# EAGLE design ESpdesign (EAGLE 9.6.2)
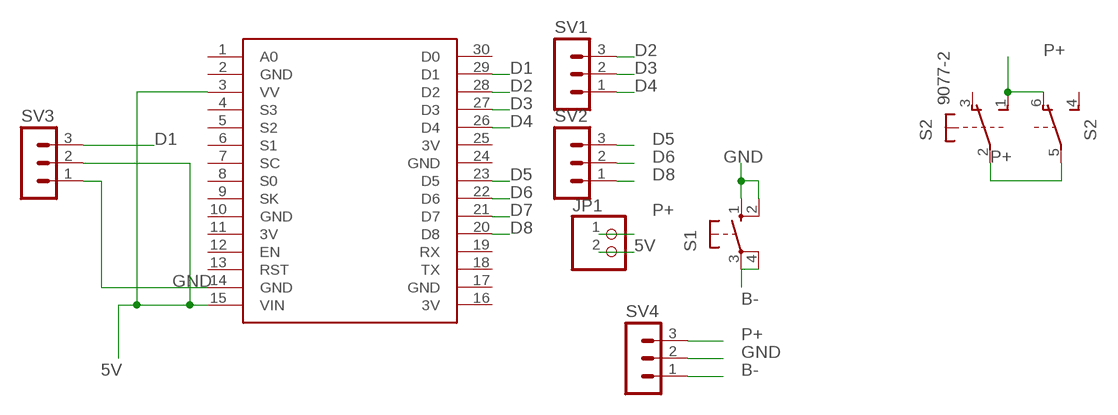
[diagram p0: schematic, sheet 1]

## Parts
JP1  PINHD-1X2  [1X02]
S1  10-XX  [B3F-10XX]
S2  9077-2  [9077-2]
SV1  MA03-1  [MA03-1]
SV2  MA03-1  [MA03-1]
SV3  MA03-1  [MA03-1]
SV4  MA03-1  [MA03-1]
U$1  NODEMCU  [NODEMCU]

## Nets
5V: JP1.2 SV3.2 U$1.3(VV) U$1.15(VIN)
B-: S1.3(P) S1.4(P1) SV4.1
D1: SV3.3 U$1.29(D1)
D2: SV1.3 U$1.28(D2)
D3: SV1.2 U$1.27(D3)
D4: SV1.1 U$1.26(D4)
D5: SV2.3 U$1.23(D5)
D6: SV2.2 U$1.22(D6)
D7: U$1.21(D7)
D8: SV2.1 U$1.20(D8)
GND: S1.1(S) S1.2(S1) SV3.1 SV4.2 U$1.14(GND)
P+: JP1.1 S2.1(1:S) S2.2(1:P) S2.5(2:P) S2.6(2:O) SV4.3
Unconnected: S2.3(1:O) S2.4(2:S) U$1.1(A0) U$1.4(S3) U$1.5(S2) U$1.6(S1) U$1.7(SC) U$1.8(S0) U$1.9(SK) U$1.12(EN) U$1.13(RST) U$1.18(TX) U$1.19(RX) U$1.30(D0)

## Power pins joined to a net without a drawn wire
3V: U$1.11(3V) U$1.16(3V) U$1.25(3V)
GND: U$1.2(GND) U$1.10(GND) U$1.17(GND) U$1.24(GND)

## Library data of the parts
JP1 = pinhead:PINHD-1X2: PIN HEADER
S1 = switch-omron:10-XX: OMRON SWITCH; MPN: B3F-1000; OC_FARNELL: 176432; OC_NEWARK: 36M3542
S2 = switch-misc-edited:9077-2: MARQUARDT SWITCH 9077.0200 Distributor: Buerklin <https://www.buerklin.com/default.asp?event=ShowArtikel%2812G2822%29&l=d&jump=ArtNr_12G2822>
SV1-SV4 = con-lstb:MA03-1: PIN HEADER; OC_FARNELL: unknown; OC_NEWARK: unknown
U$1 = nodemcu:NODEMCU

## Board
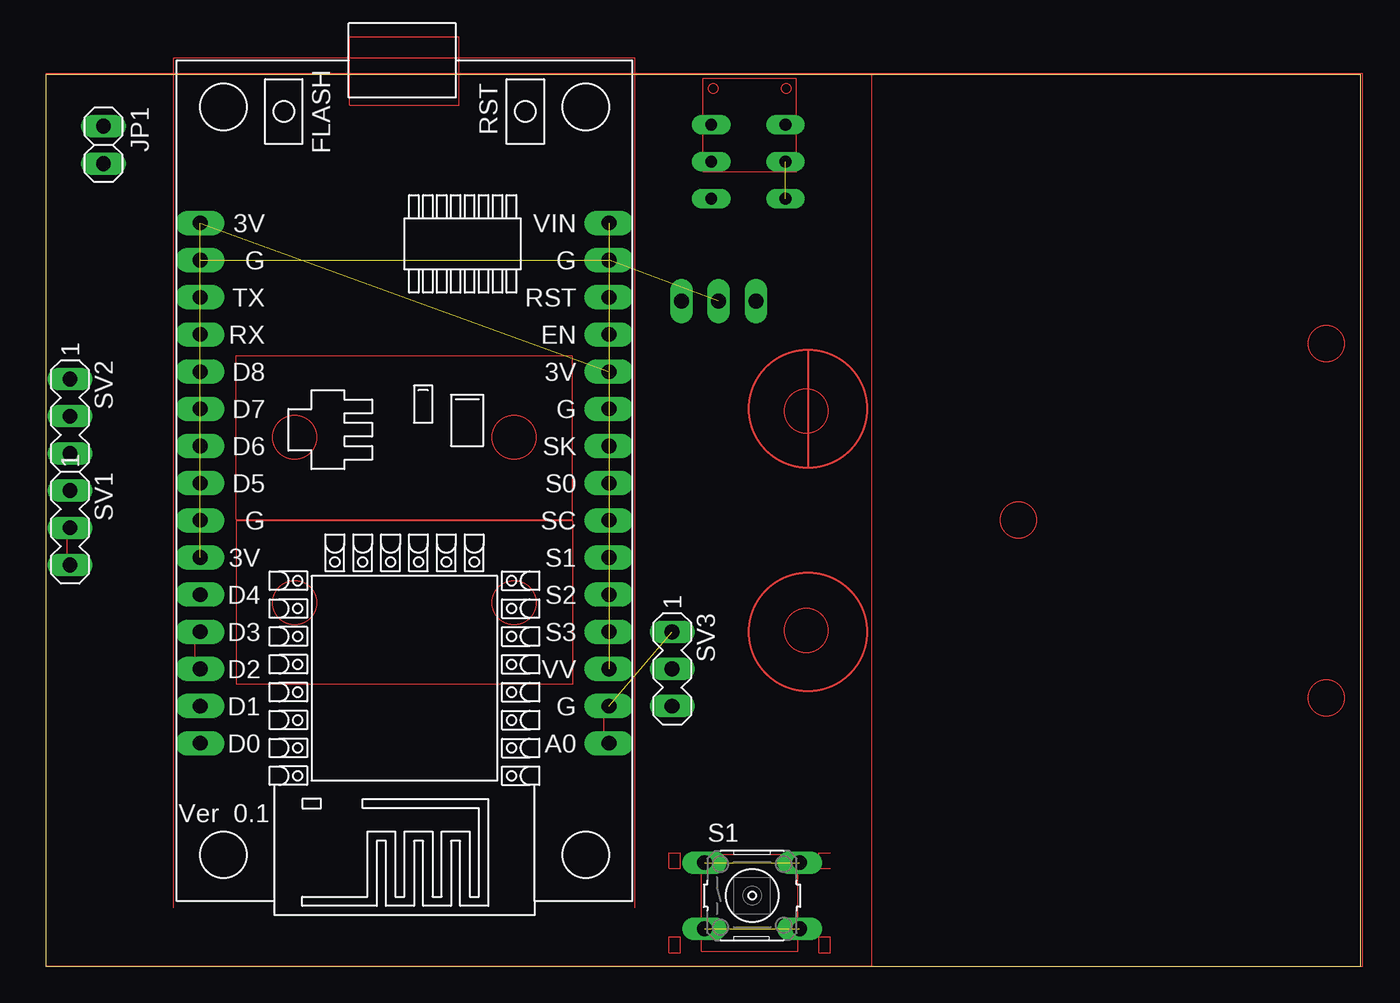
[diagram p1: board, top side]
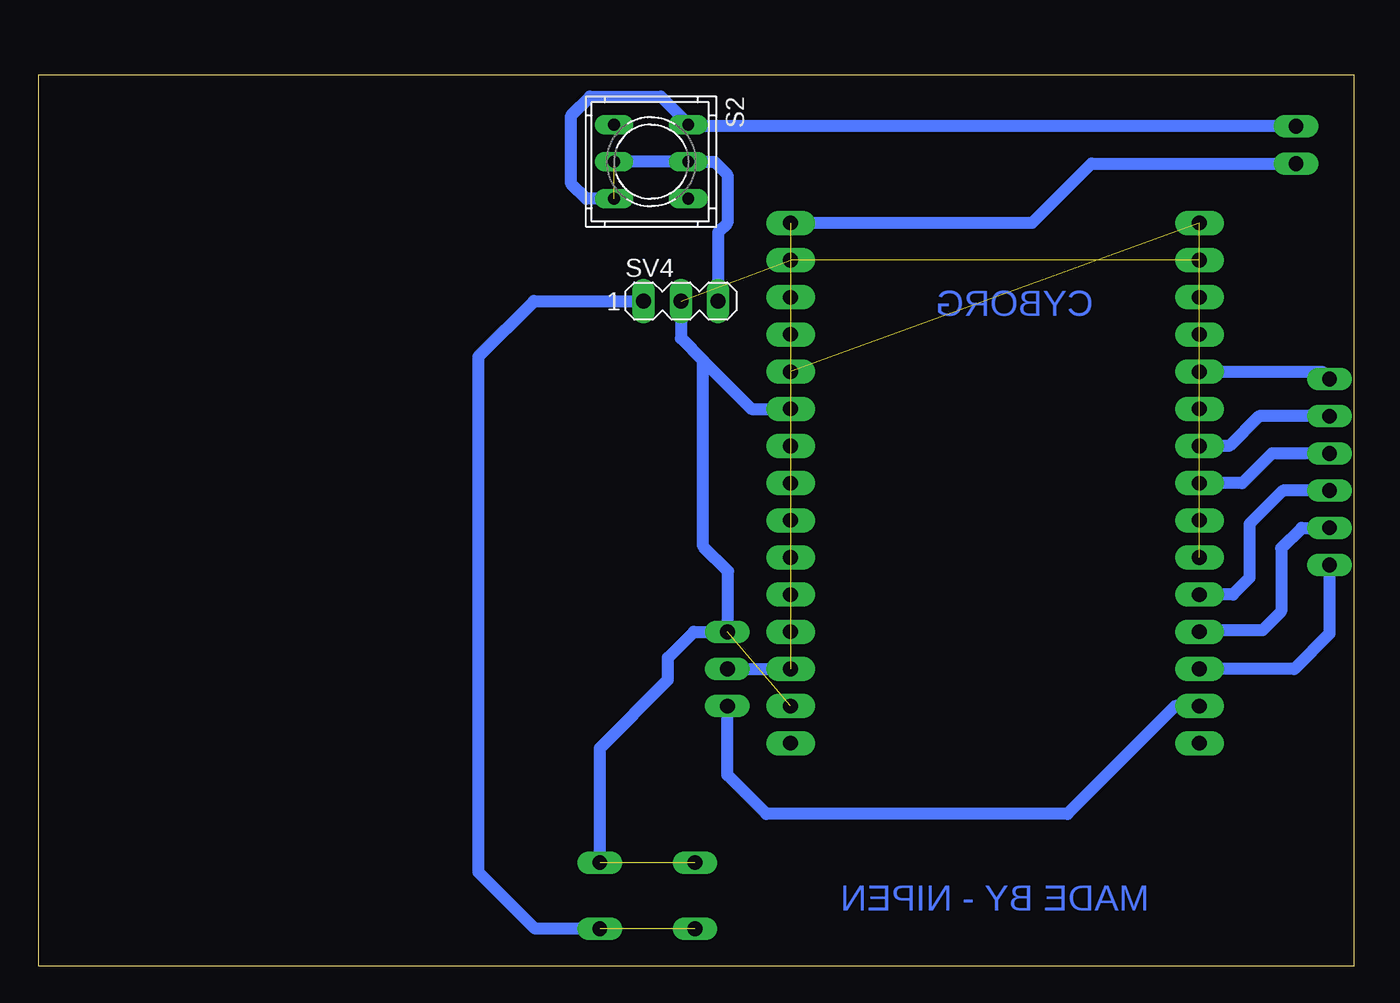
[diagram p2: board, bottom side, seen from below]

Size 89.84 x 60.95 mm. Coordinates in mm from the lower left corner, seen from the top.
Outline: 0,0 89.84,0 89.84,60.95 0,60.95 0,0
Copper layers (1*16): Top 0.035mm / dielectric 1.5mm / Bottom 0.035mm
Design rules "default": minimum track width 6mil, minimum drill 0.35mm, track to track 6mil, track to pad 6mil, pad to pad 6mil, via to via 6mil, smd to smd 6mil, copper to edge 40mil, drill to drill 6mil, minimum pad ring 10mil, minimum via ring 8mil, stop-mask expansion 4mil, vias tented up to drill 0mil, thermal gap 10mil

### Footprints (pad centres in the part's own frame; a part is rotated, then mirrored left to right if it is on the bottom)
1X02 = drill 1.016 long: 1 -1.27,0; 2 1.27,0
B3F-10XX = drill 1.016 long: 1 -3.251,2.261; 2 3.251,2.261; 3 -3.251,-2.261; 4 3.251,-2.261
9077-2 = drill 0.813 long: 1 -2.54,2.54; 2 0,2.54; 3 2.54,2.54; 4 -2.54,-2.54; 5 0,-2.54; 6 2.54,-2.54
MA03-1 = drill 1.016 long: 1 -2.54,0; 2 0,0; 3 2.54,0
NODEMCU = drill 1 pad 1.676 long: 1 -13.97,17.78; 2 -13.97,15.24; 3 -13.97,12.7; 4 -13.97,10.16; 5 -13.97,7.62; 6 -13.97,5.08; 7 -13.97,2.54; 8 -13.97,0; 9 -13.97,-2.54; 10 -13.97,-5.08; 11 -13.97,-7.62; 12 -13.97,-10.16; 13 -13.97,-12.7; 14 -13.97,-15.24; 15 -13.97,-17.78; 16 13.97,-17.78; 17 13.97,-15.24; 18 13.97,-12.7; 19 13.97,-10.16; 20 13.97,-7.62; 21 13.97,-5.08; 22 13.97,-2.54; 23 13.97,0; 24 13.97,2.54; 25 13.97,5.08; 26 13.97,7.62; 27 13.97,10.16; 28 13.97,12.7; 29 13.97,15.24; 30 13.97,17.78

### Placement (x,y rotation side)
JP1  3.94,56.13 270 top
S1  48.26,4.83 0 top
S2  48.01,54.99 270 bottom
SV1  1.65,29.97 270 top
SV2  1.65,37.59 270 top
SV3  42.8,20.32 270 top
SV4  45.97,45.47 0 bottom
U$1  24.51,33.02 180 top

### Tracks (layer width: path | path; a pad name or v marks a point on that pad's centre or on a via)
3V  (2 unrouted)
5V  (1 unrouted)
  Bottom 0.813: JP1.2 17.91,54.86 21.97,50.8 U$1.15 | SV3.2 U$1.3
B-  (1 unrouted)
  Bottom 0.813: SV4.1 56.01,45.47 59.82,41.66 59.82,6.45 55.93,2.56 S1.4
D1
  Bottom 0.813: U$1.29 12.19,17.78 19.56,10.41 40.13,10.41 42.8,13.08 SV3.3
D2
  Bottom 0.813: SV1.3 1.65,22.73 4.06,20.32 U$1.28
D3
  Bottom 0.813: SV1.2 3.56,29.97 4.95,28.57 4.95,24.26 6.22,22.99 10.41,22.99 U$1.27
D4
  Bottom 0.813: SV1.1 4.83,32.51 7.11,30.23 7.11,26.54 8.26,25.4 U$1.26
D5
  Bottom 0.813: SV2.3 5.59,35.05 7.62,33.02 U$1.23
D6
  Bottom 0.813: SV2.2 6.48,37.59 8.51,35.56 U$1.22
D8
  Bottom 0.813: SV2.1 2.16,40.64 U$1.20
GND  (5 unrouted)
  Bottom 0.813: 45.97,44.45 SV4.2 45.97,42.93 44.45,41.4 | U$1.10 41.15,38.1 44.45,41.4 | 44.45,41.4 44.45,28.7 42.8,27.05 | 42.74,26.99 42.8,27.05 | S1.2 51.51,14.91 46.86,19.56 46.86,21.08 45.09,22.86 SV3.1 42.8,27.05
N$1
  Top 0.001: 56.46,0 0,0 0,61 56.46,61 | 56.46,0 56.46,61 | 56.46,0 90,0 90,61 56.46,61
N$2
  Top 0.001: 36,30.45 13,30.45 13,19.25 36,19.25 36,30.45
N$3
  Top 0.001: 13,30.55 36,30.55 36,41.75 13,41.75 13,30.55
N$5
  Top 0.001: 1.45,27.66 1.45,27.3 1.85,27.3 1.85,27.66 1.45,27.66 | 1.45,29.84 1.45,30.2 1.85,30.2 1.85,29.84 1.45,29.84 | 1.45,27.66 1.45,29.84
N$6
  Top 0.001: 44.91,54.31 51.29,54.31 51.29,60.69 44.91,60.69 44.91,54.31
N$7
  Top 0.001: 1.45,32.38 1.45,32.73 1.85,32.73 1.85,32.38 1.45,32.38
N$8
  Top 0.001: 1.45,34.92 1.45,35.27 1.85,35.27 1.85,34.92 1.45,34.92
N$9
  Top 0.001: 1.45,37.47 1.45,37.81 1.85,37.81 1.85,37.47 1.45,37.47
N$10
  Top 0.001: 1.45,40.01 1.45,40.35 1.85,40.35 1.85,40.01 1.45,40.01
N$12
  Top 0.001: 38.15,15.58 38.15,14.94 38.79,14.94 38.79,15.58 38.15,15.58 | 38.15,17.48 38.15,18.12 38.79,18.12 38.79,17.48 38.15,17.48 | 38.15,15.58 38.15,17.48
N$13
  Top 0.001: 38.15,20.02 38.15,20.66 38.79,20.66 38.79,20.02 38.15,20.02
N$14
  Top 0.001: 38.15,22.56 38.15,23.2 38.79,23.2 38.79,22.56 38.15,22.56
N$15
  Top 0.001: 38.15,25.1 38.15,25.74 38.79,25.74 38.79,25.1 38.15,25.1
N$16
  Top 0.001: 38.15,27.64 38.15,28.28 38.79,28.28 38.79,27.64 38.15,27.64
N$17
  Top 0.001: 38.15,30.18 38.15,30.82 38.79,30.82 38.79,30.18 38.15,30.18
N$18
  Top 0.001: 38.15,32.72 38.15,33.36 38.79,33.36 38.79,32.72 38.15,32.72
N$19
  Top 0.001: 38.15,35.26 38.15,35.9 38.79,35.9 38.79,35.26 38.15,35.26
N$20
  Top 0.001: 38.15,37.8 38.15,38.44 38.79,38.44 38.79,37.8 38.15,37.8
N$21
  Top 0.001: 38.15,40.34 38.15,40.98 38.79,40.98 38.79,40.34 38.15,40.34
N$22
  Top 0.001: 38.15,42.88 38.15,43.52 38.79,43.52 38.79,42.88 38.15,42.88
N$23
  Top 0.001: 38.15,45.42 38.15,46.06 38.79,46.06 38.79,45.42 38.15,45.42
N$24
  Top 0.001: 38.15,47.96 38.15,48.6 38.79,48.6 38.79,47.96 38.15,47.96
N$25
  Top 0.001: 38.15,50.5 38.15,51.14 38.79,51.14 38.79,50.5 38.15,50.5
N$27
  Top 0.001: 42.58,0.92 43.37,0.92 43.37,2 42.58,2 42.58,0.92
N$28
  Top 0.001: 42.58,6.68 43.37,6.68 43.37,7.76 42.58,7.76 42.58,6.68
N$29
  Top 0.001: 52.82,0.92 53.62,0.92 53.62,2 52.82,2 52.82,0.92
N$30
  Top 0.001: 53.62,6.68 52.82,6.68 52.82,7.76 53.62,7.76
N$31
  Top 0.001: 44.79,1.03 51.41,1.03 51.41,7.65 44.79,7.65 44.79,1.03
N$32
  Top 0.001: 10.21,20.66 10.21,20.02 10.85,20.02 10.85,20.66 10.21,20.66 | 10.21,22.56 10.21,23.2 10.85,23.2 10.85,22.56 10.21,22.56 | 10.21,20.66 10.21,22.56
N$33
  Top 0.001: 10.21,25.1 10.21,25.74 10.85,25.74 10.85,25.1 10.21,25.1
N$34
  Top 0.001: 10.21,27.64 10.21,28.28 10.85,28.28 10.85,27.64 10.21,27.64
N$35
  Top 0.001: 10.21,30.18 10.21,30.82 10.85,30.82 10.85,30.18 10.21,30.18
N$36
  Top 0.001: 10.21,32.72 10.21,33.36 10.85,33.36 10.85,32.72 10.21,32.72
N$37
  Top 0.001: 10.21,35.26 10.21,35.9 10.85,35.9 10.85,35.26 10.21,35.26
N$38
  Top 0.001: 10.21,37.8 10.21,38.44 10.85,38.44 10.85,37.8 10.21,37.8
N$39
  Top 0.001: 10.21,40.34 10.21,40.98 10.85,40.98 10.85,40.34 10.21,40.34
N$40
  Top 0.001: 20.75,58.84 28.25,58.84 28.25,63.54 20.75,63.54 20.75,58.84
N$41
  Top 0.001: 8.75,3.99 8.75,62.09 40.25,62.09 40.25,3.99
P+  (1 unrouted)
  Bottom 0.813: JP1.1 45.31,57.4 | 45.31,57.4 S2.1 | SV4.3 43.43,50.16 42.8,50.8 42.8,54.1 43.69,54.99 S2.2 S2.5 | S2.6 52.45,52.45 53.47,53.47 53.47,58.17 52.2,59.44 47.34,59.44 45.31,57.4
(copper drawn outside any net)
  shapes: Top area x1, Top circle x17

### Text on the board
Bottom: CYBORG | MADE BY - NIPEN